# EAGLE design general (EAGLE 9.6.2)

## Sheet 1 of 4
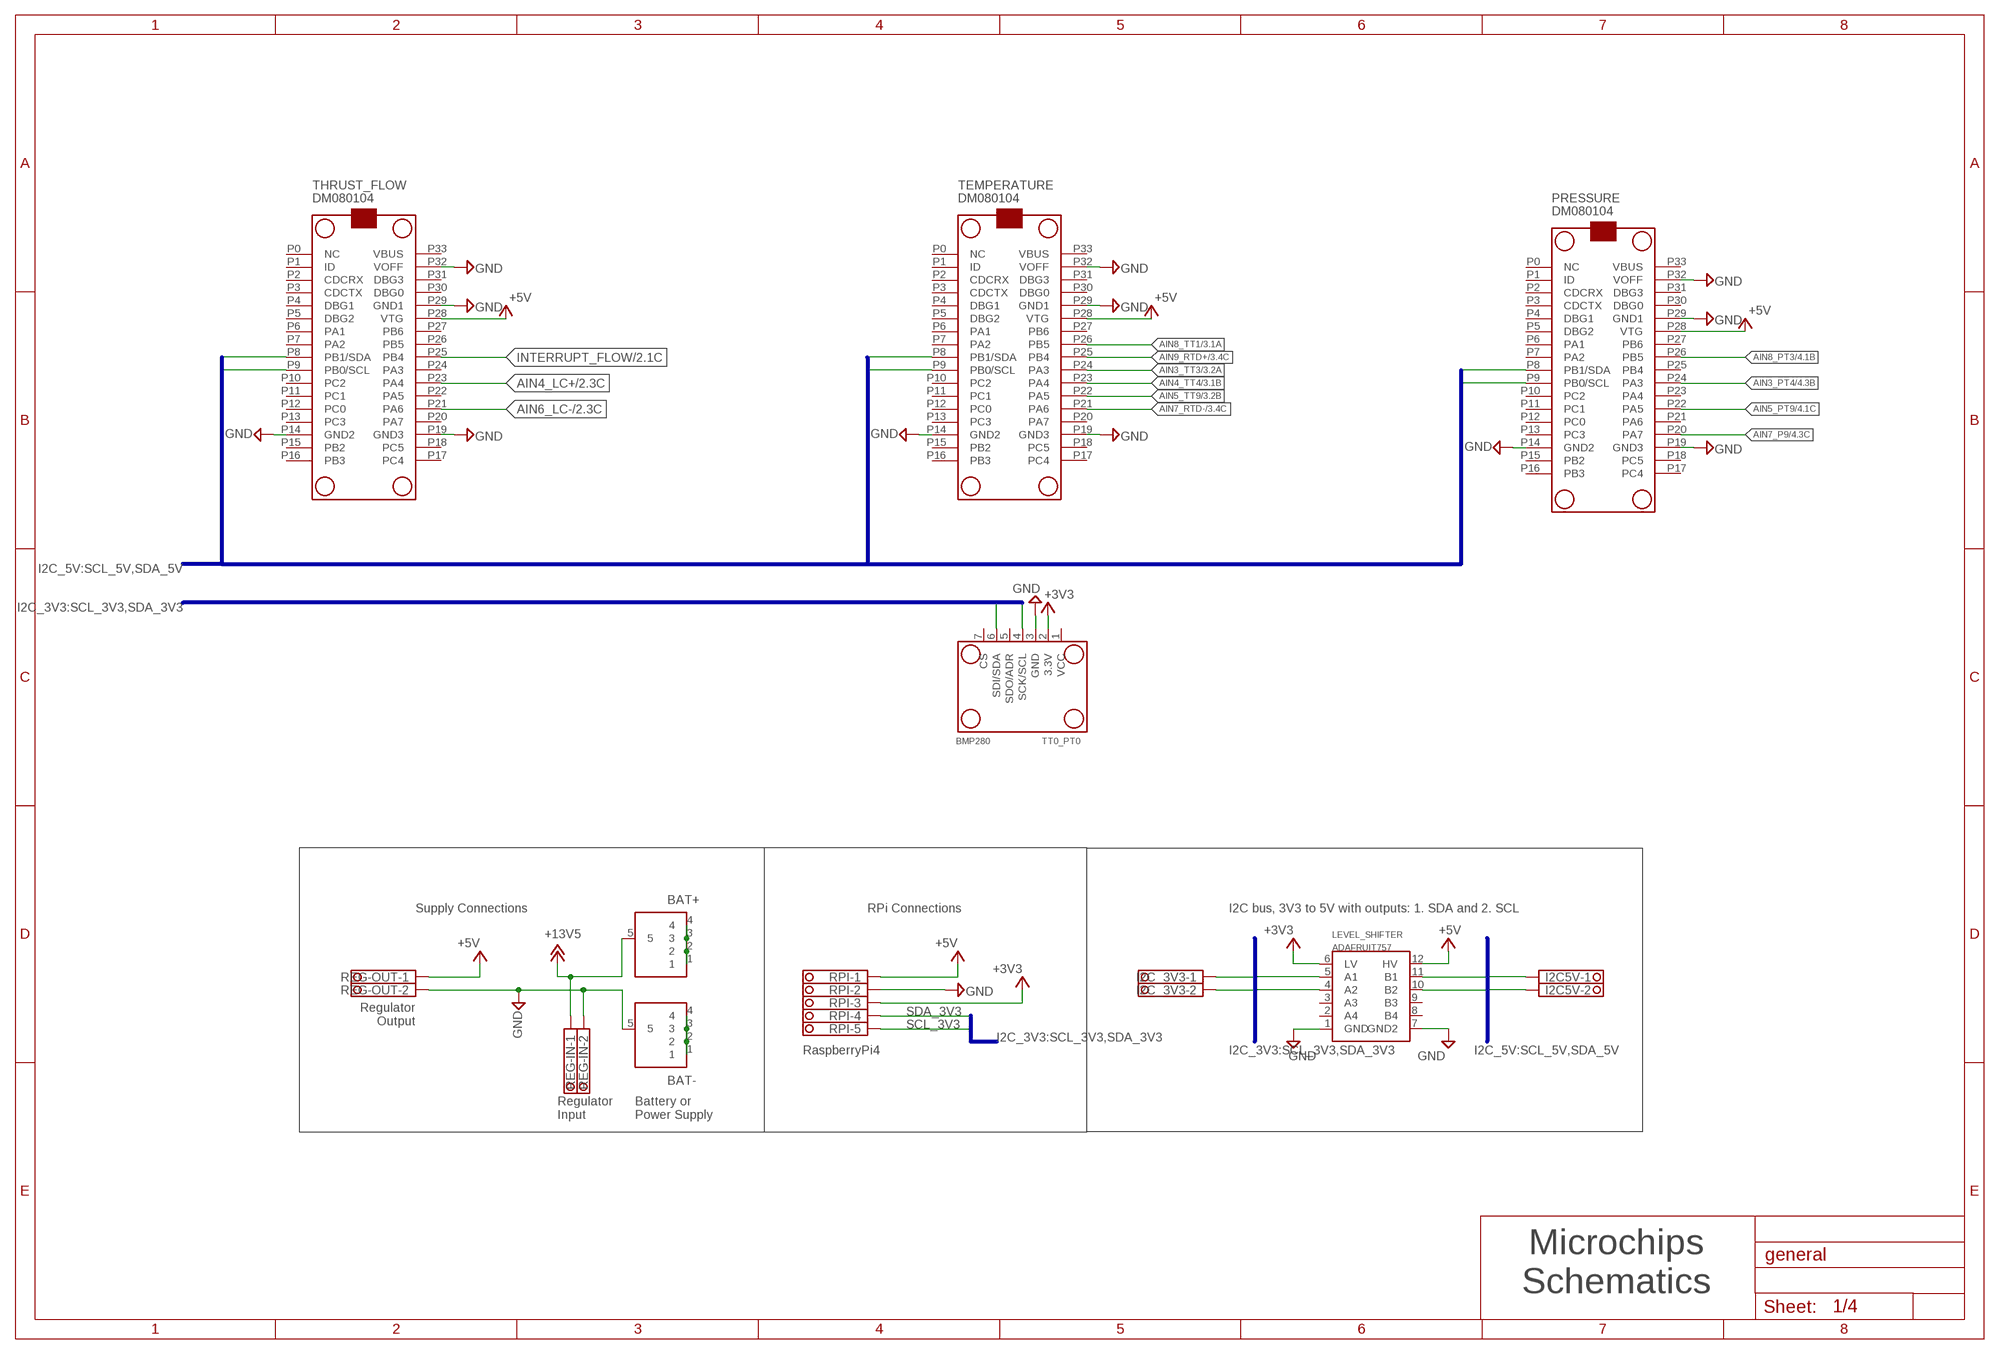
[diagram p0: schematic, sheet 1]

### Parts
BAT+  73099-2730990  [730990]
BAT-  73099-0  [730990]
I2C5V  1751248  [1751248]
I2C_3V3  1751248  [1751248]
LEVEL_SHIFTER  ADAFRUIT757  [ADAFRUIT757]
PRESSURE  DM080104  [DM080104]
REG-IN  1751248  [1751248]
REG-OUT  1751248  [1751248]
RPI  1751277  [1751277]
TEMPERATURE  DM080104  [DM080104]
THRUST_FLOW  DM080104  [DM080104]
TT0_PT0  BMP280  [BMP280]

### Nets
+3V3: LEVEL_SHIFTER.6(LV) RPI.3 TT0_PT0.2(3.3V) ; also sheet 4
+5V: LEVEL_SHIFTER.12(HV) PRESSURE.P28(VTG) REG-OUT.1 RPI.1 TEMPERATURE.P28(VTG) THRUST_FLOW.P28(VTG) ; also sheet 2,3
+13V5: BAT+.5 REG-IN.1 ; also sheet 4
AIN3_PT4: PRESSURE.P24(PA3) ; also sheet 4
AIN3_TT3: TEMPERATURE.P24(PA3) ; also sheet 3
AIN4_LC+: THRUST_FLOW.P23(PA4) ; also sheet 2
AIN4_TT4: TEMPERATURE.P23(PA4) ; also sheet 3
AIN5_PT9: PRESSURE.P22(PA5) ; also sheet 4
AIN5_TT9: TEMPERATURE.P22(PA5) ; also sheet 3
AIN6_LC-: THRUST_FLOW.P21(PA6) ; also sheet 2
AIN7_P9: PRESSURE.P20(PA7) ; also sheet 4
AIN7_RTD-: TEMPERATURE.P21(PA6) ; also sheet 3
AIN8_PT3: PRESSURE.P26(PB5) ; also sheet 4
AIN8_TT1: TEMPERATURE.P26(PB5) ; also sheet 3
AIN9_RTD+: TEMPERATURE.P25(PB4) ; also sheet 3
GND: BAT-.5 LEVEL_SHIFTER.1(GND) LEVEL_SHIFTER.7(GND2) PRESSURE.P14(GND2) PRESSURE.P19(GND3) PRESSURE.P29(GND1) PRESSURE.P32(VOFF) REG-IN.2 REG-OUT.2 RPI.2 TEMPERATURE.P14(GND2) TEMPERATURE.P19(GND3) TEMPERATURE.P29(GND1) TEMPERATURE.P32(VOFF) THRUST_FLOW.P14(GND2) THRUST_FLOW.P19(GND3) THRUST_FLOW.P29(GND1) THRUST_FLOW.P32(VOFF) TT0_PT0.3(GND) ; also sheet 2,3,4
INTERRUPT_FLOW: THRUST_FLOW.P25(PB4) ; also sheet 2
N$3: BAT+.1 BAT+.2 BAT+.3 BAT+.4
N$4: BAT-.1 BAT-.2 BAT-.3 BAT-.4
SCL_3V3: I2C_3V3.2 LEVEL_SHIFTER.4(A2) RPI.5 TT0_PT0.4(SCK/SCL) ; also sheet 4
SCL_5V: I2C5V.2 LEVEL_SHIFTER.10(B2) PRESSURE.P9(PB0/SCL) TEMPERATURE.P9(PB0/SCL) THRUST_FLOW.P9(PB0/SCL)
SDA_3V3: I2C_3V3.1 LEVEL_SHIFTER.5(A1) RPI.4 TT0_PT0.6(SDI/SDA) ; also sheet 4
SDA_5V: I2C5V.1 LEVEL_SHIFTER.11(B1) PRESSURE.P8(PB1/SDA) TEMPERATURE.P8(PB1/SDA) THRUST_FLOW.P8(PB1/SDA)
Unconnected: LEVEL_SHIFTER.2(A4) LEVEL_SHIFTER.3(A3) LEVEL_SHIFTER.8(B4) LEVEL_SHIFTER.9(B3) PRESSURE.P0(NC) PRESSURE.P1(ID) PRESSURE.P2(CDCRX) PRESSURE.P3(CDCTX) PRESSURE.P4(DBG1) PRESSURE.P5(DBG2) PRESSURE.P6(PA1) PRESSURE.P7(PA2) PRESSURE.P10(PC2) PRESSURE.P11(PC1) PRESSURE.P12(PC0) PRESSURE.P13(PC3) PRESSURE.P15(PB2) PRESSURE.P16(PB3) PRESSURE.P17(PC4) PRESSURE.P18(PC5) PRESSURE.P21(PA6) PRESSURE.P23(PA4) PRESSURE.P25(PB4) PRESSURE.P27(PB6) PRESSURE.P30(DBG0) PRESSURE.P31(DBG3) PRESSURE.P33(VBUS) TEMPERATURE.P0(NC) TEMPERATURE.P1(ID) TEMPERATURE.P2(CDCRX) TEMPERATURE.P3(CDCTX) TEMPERATURE.P4(DBG1) TEMPERATURE.P5(DBG2) TEMPERATURE.P6(PA1) TEMPERATURE.P7(PA2) TEMPERATURE.P10(PC2) TEMPERATURE.P11(PC1) TEMPERATURE.P12(PC0) TEMPERATURE.P13(PC3) TEMPERATURE.P15(PB2) TEMPERATURE.P16(PB3) TEMPERATURE.P17(PC4) TEMPERATURE.P18(PC5) TEMPERATURE.P20(PA7) TEMPERATURE.P27(PB6) TEMPERATURE.P30(DBG0) TEMPERATURE.P31(DBG3) TEMPERATURE.P33(VBUS) THRUST_FLOW.P0(NC) THRUST_FLOW.P1(ID) THRUST_FLOW.P2(CDCRX) THRUST_FLOW.P3(CDCTX) THRUST_FLOW.P4(DBG1) THRUST_FLOW.P5(DBG2) THRUST_FLOW.P6(PA1) THRUST_FLOW.P7(PA2) THRUST_FLOW.P10(PC2) THRUST_FLOW.P11(PC1) THRUST_FLOW.P12(PC0) THRUST_FLOW.P13(PC3) THRUST_FLOW.P15(PB2) THRUST_FLOW.P16(PB3) THRUST_FLOW.P17(PC4) THRUST_FLOW.P18(PC5) THRUST_FLOW.P20(PA7) THRUST_FLOW.P22(PA5) THRUST_FLOW.P24(PA3) THRUST_FLOW.P26(PB5) THRUST_FLOW.P27(PB6) THRUST_FLOW.P30(DBG0) THRUST_FLOW.P31(DBG3) THRUST_FLOW.P33(VBUS) TT0_PT0.1(VCC) TT0_PT0.5(SDO/ADR) TT0_PT0.7(CS)

### Buses
I2C_3V3:SCL_3V3,SDA_3V3
I2C_5V:SCL_5V,SDA_5V

### Notes on the sheet
- Supply Connections | RPi Connections | I2C bus, 3V3 to 5V with outputs: 1. SDA and 2. SCL
- Regulator
  Output
- RaspberryPi4
- Regulator
  Input
- Battery or
  Power Supply
- Microchips
  Schematics

## Sheet 2 of 4
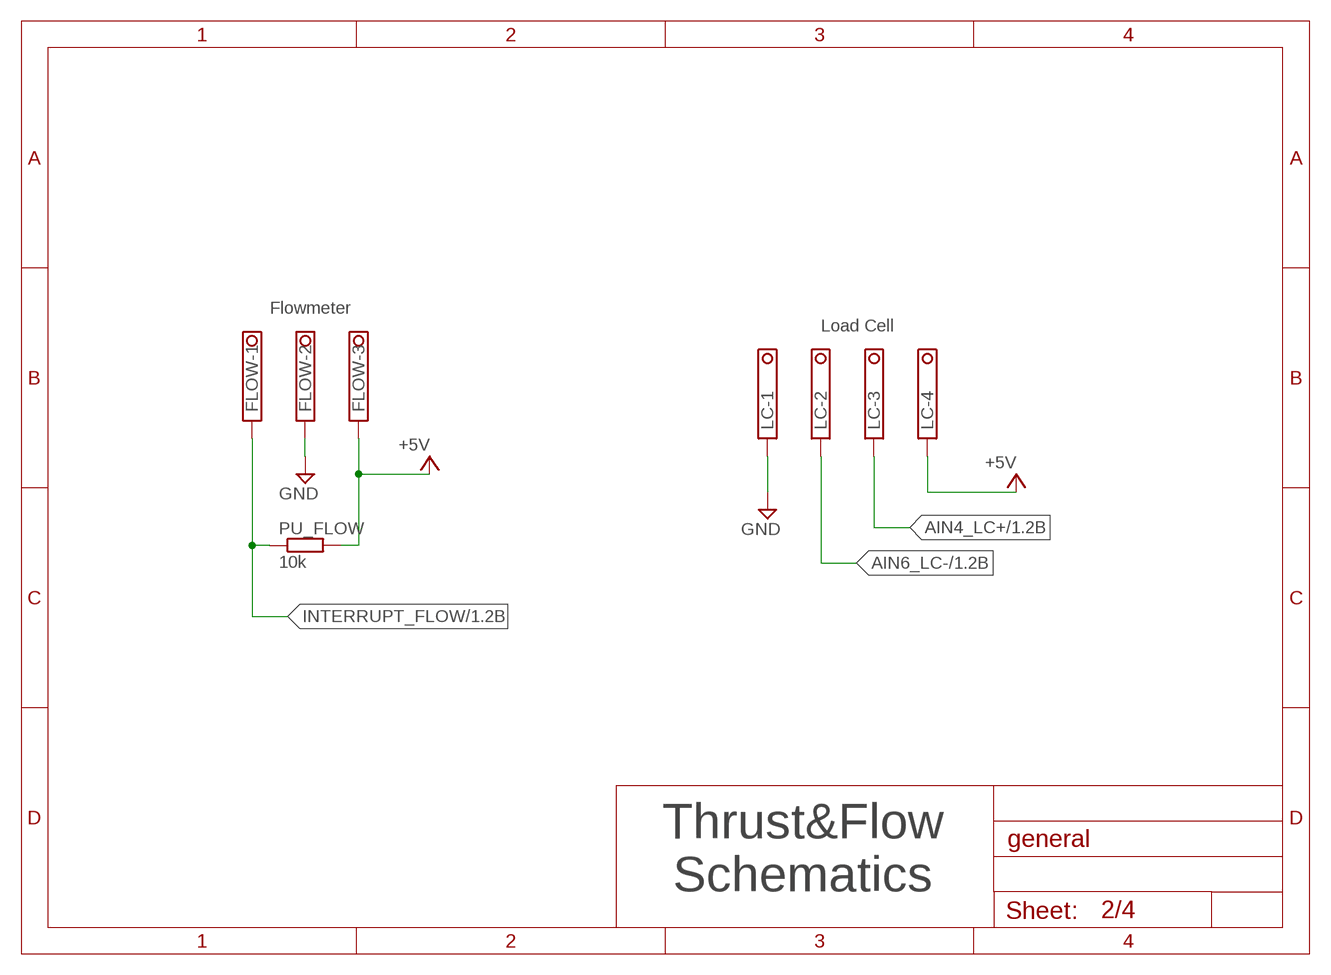
[diagram p1: schematic, sheet 2]

### Parts
FLOW  1751251  [1751251]
LC  1751264  [1751264]
PU_FLOW  10k  R-EU_0207/10  [0207/10]

### Nets
+5V: FLOW.3 LC.4 PU_FLOW.2 ; also sheet 1,3
AIN4_LC+: LC.3 ; also sheet 1
AIN6_LC-: LC.2 ; also sheet 1
GND: FLOW.2 LC.1 ; also sheet 1,3,4
INTERRUPT_FLOW: FLOW.1 PU_FLOW.1 ; also sheet 1

### Notes on the sheet
- Flowmeter
- Load Cell
- Thrust&Flow
  Schematics

## Sheet 3 of 4
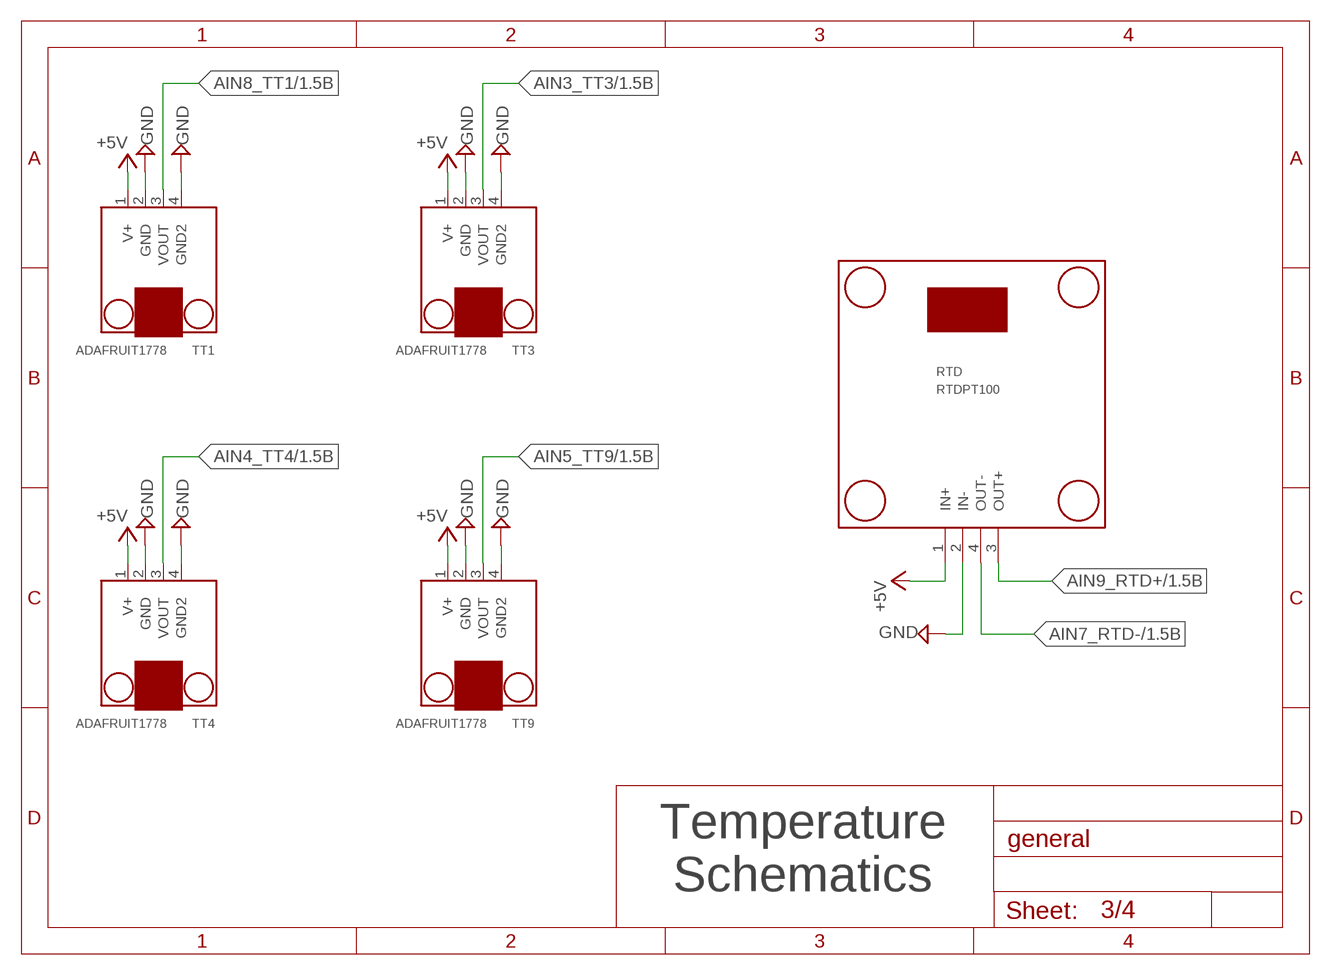
[diagram p2: schematic, sheet 3]

### Parts
RTD  RTDPT100  [RTDPT100]
TT1  ADAFRUIT1778  [ADAFRUIT1778]
TT3  ADAFRUIT1778  [ADAFRUIT1778]
TT4  ADAFRUIT1778  [ADAFRUIT1778]
TT9  ADAFRUIT1778  [ADAFRUIT1778]

### Nets
+5V: RTD.1(IN+) TT1.1(V+) TT3.1(V+) TT4.1(V+) TT9.1(V+) ; also sheet 1,2
AIN3_TT3: TT3.3(VOUT) ; also sheet 1
AIN4_TT4: TT4.3(VOUT) ; also sheet 1
AIN5_TT9: TT9.3(VOUT) ; also sheet 1
AIN7_RTD-: RTD.4(OUT-) ; also sheet 1
AIN8_TT1: TT1.3(VOUT) ; also sheet 1
AIN9_RTD+: RTD.3(OUT+) ; also sheet 1
GND: RTD.2(IN-) TT1.2(GND) TT1.4(GND2) TT3.2(GND) TT3.4(GND2) TT4.2(GND) TT4.4(GND2) TT9.2(GND) TT9.4(GND2) ; also sheet 1,2,4

### Notes on the sheet
- Temperature
  Schematics

## Sheet 4 of 4
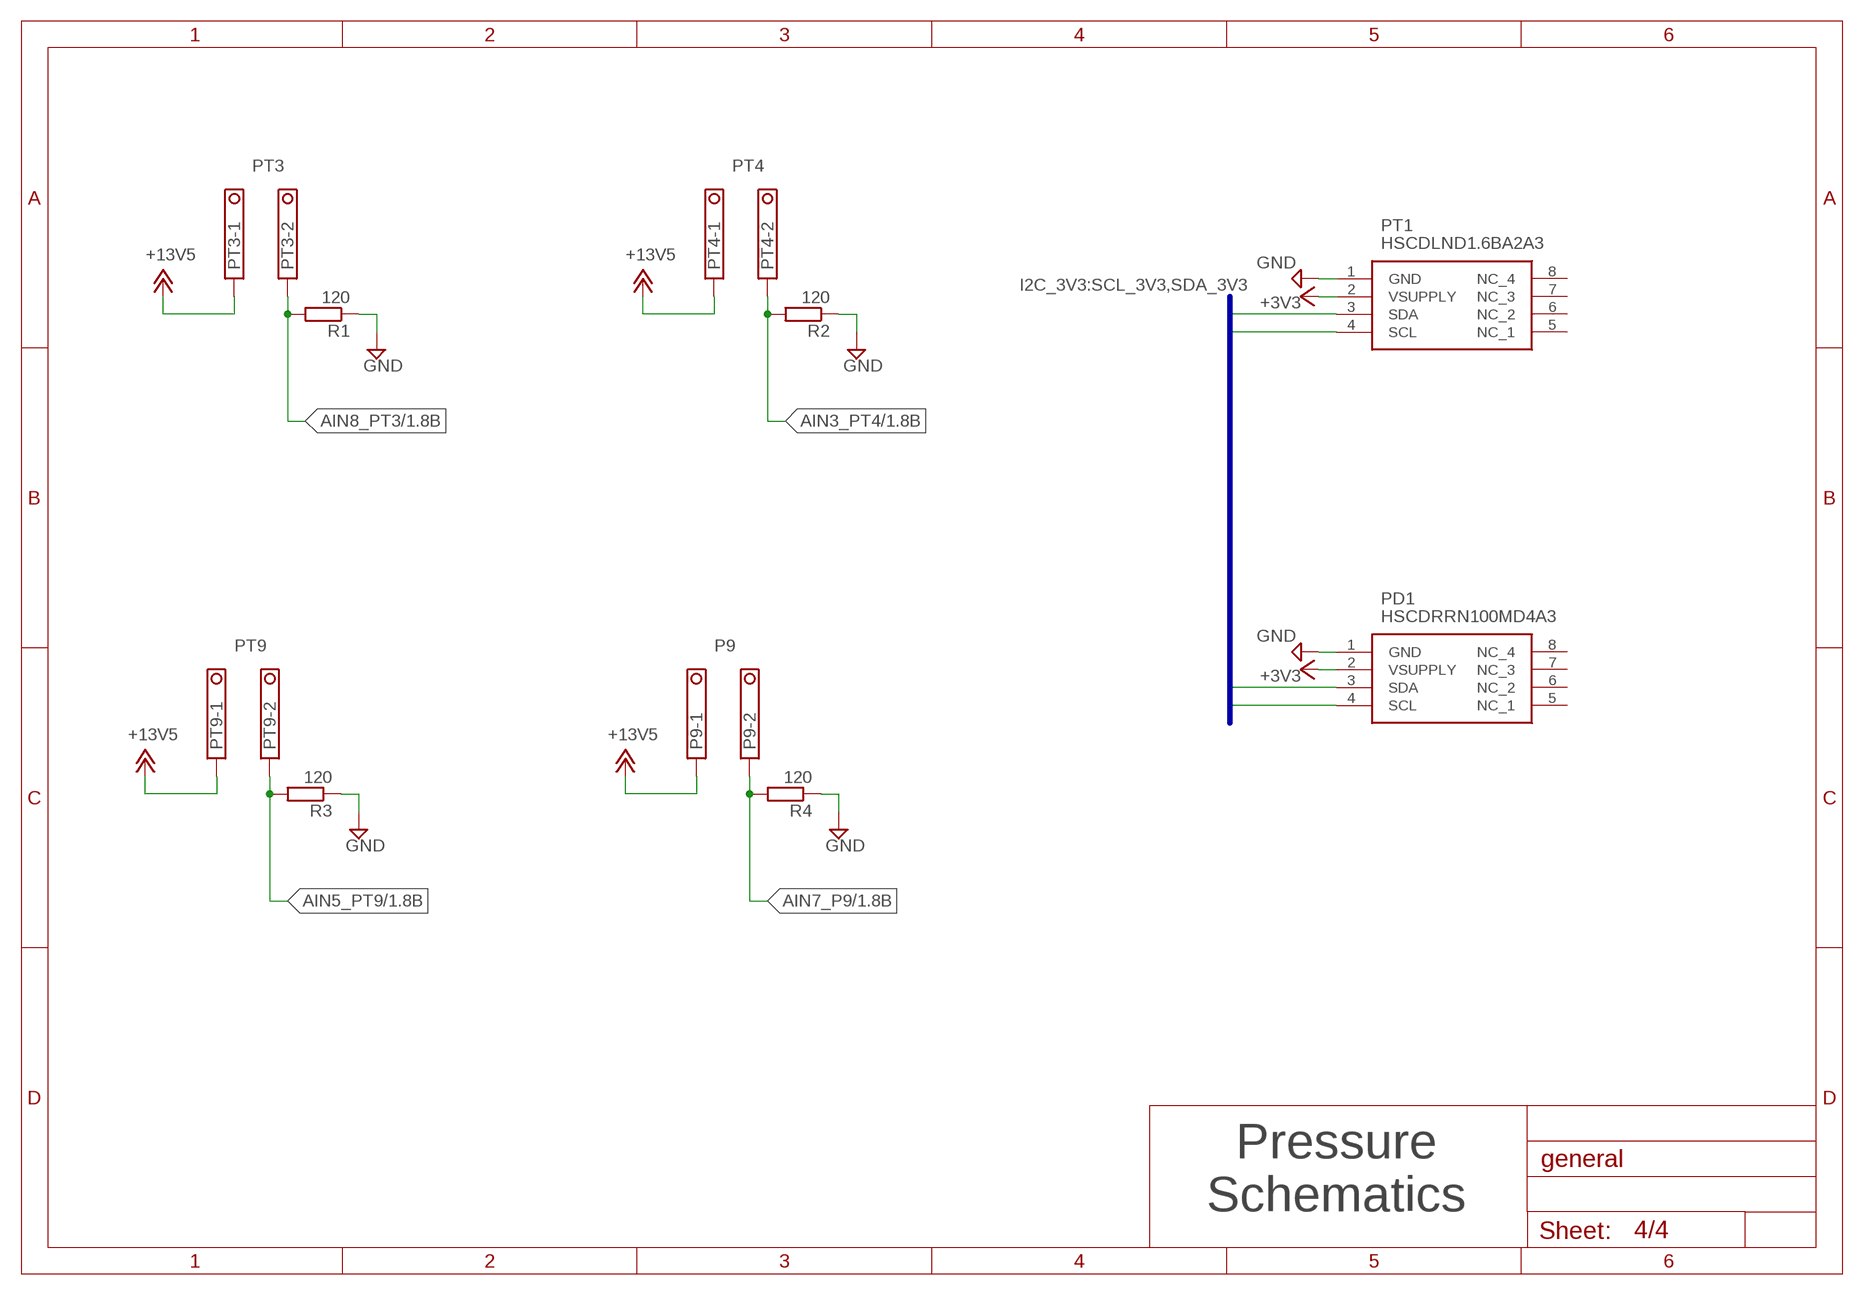
[diagram p3: schematic, sheet 4]

### Parts
P9  1751248  [1751248]
PD1  HSCDRRN100MD4A3  [HSCDRRN100MD4A3]
PT1  HSCDLND1.6BA2A3  [HSCDLND1.6BA2A3]
PT3  1751248  [1751248]
PT4  1751248  [1751248]
PT9  1751248  [1751248]
R1  120  R-EU_0207/10  [0207/10]
R2  120  R-EU_0207/10  [0207/10]
R3  120  R-EU_0207/10  [0207/10]
R4  120  R-EU_0207/10  [0207/10]

### Nets
+3V3: PD1.2(VSUPPLY) PT1.2(VSUPPLY) ; also sheet 1
+13V5: P9.1 PT3.1 PT4.1 PT9.1 ; also sheet 1
AIN3_PT4: PT4.2 R2.2 ; also sheet 1
AIN5_PT9: PT9.2 R3.2 ; also sheet 1
AIN7_P9: P9.2 R4.2 ; also sheet 1
AIN8_PT3: PT3.2 R1.2 ; also sheet 1
GND: PD1.1(GND) PT1.1(GND) R1.1 R2.1 R3.1 R4.1 ; also sheet 1,2,3
SCL_3V3: PD1.4(SCL) PT1.4(SCL) ; also sheet 1
SDA_3V3: PD1.3(SDA) PT1.3(SDA) ; also sheet 1
Unconnected: PD1.5(NC_1) PD1.6(NC_2) PD1.7(NC_3) PD1.8(NC_4) PT1.5(NC_1) PT1.6(NC_2) PT1.7(NC_3) PT1.8(NC_4)

### Buses
I2C_3V3:SCL_3V3,SDA_3V3

### Notes on the sheet
- PT3 | PT4
- PT9 | P9
- Pressure
  Schematics

## Library data of the parts
BAT+ = general_lib:73099-2: Test Plugs & Test Jacks RT ANG 4mm MOUNTING SAFETY JACK PCB RED Source: Datasheet <https://www.mouser.com/datasheet/2/159/d73099_101-1649201.pdf>
BAT- = general_lib:73099-0: Test Plugs & Test Jacks RT ANG 4mm MOUNTING SAFETY JACK PCB BLK Source: Datasheet <http://assets.edgenet.com/bc247afe-c6d3-4b5e-af4b-80e7f9cda64b>; DESCRIPTION: Test Plugs & Test Jacks RT ANG 4mm MOUNTING SAFETY JACK PCB BLK; HEIGHT: 11.5mm; MANUFACTURER_NAME: Pomona Electronics; MANUFACTURER_PART_NUMBER: 73099-0; MOUSER_PART_NUMBER: 565-73099-0; MOUSER_PRICE-STOCK: https://www.mouser.co.uk/ProductDetail/Pomona-Electronics/73099-0?qs=B6kkDfuK7%2FDgwxUVoyhL3Q%3D%3D
FLOW = con-phoenix-350:1751251: MKDS 1/ 3-3,5 Printklemme Nennstrom: 10 A Bemessungsspannung: 160 V Raster: 3,5 mm Polzahl: 3 Montageart: Löten Anschlussart: Schraubanschluss Anschlussrichtung vom Leiter zur Platine: 0° Source: http://eshop.phoenixcontact.com .. 1751251.pdf; OC_FARNELL: unknown; OC_NEWARK: unknown
I2C5V I2C_3V3 P9 PT3 PT4 PT9 REG-IN REG-OUT = con-phoenix-350:1751248: MKDS 1/ 2-3,5 Printklemme Nennstrom: 10 A Bemessungsspannung: 160 V Raster: 3,5 mm Polzahl: 2 Montageart: Löten Anschlussart: Schraubanschluss Anschlussrichtung vom Leiter zur Platine: 0° Source: http://eshop.phoenixcontact.com .. 1751248.pdf; OC_FARNELL: unknown; OC_NEWARK: unknown
LC = con-phoenix-350:1751264: MKDS 1/ 4-3,5 Printklemme Nennstrom: 10 A Bemessungsspannung: 160 V Raster: 3,5 mm Polzahl: 4 Montageart: Löten Anschlussart: Schraubanschluss Anschlussrichtung vom Leiter zur Platine: 0° Source: http://eshop.phoenixcontact.com .. 1751264.pdf; MPN: 1751264; OC_FARNELL: unknown; OC_NEWARK: 10R0934
LEVEL_SHIFTER = general_lib:ADAFRUIT757
PD1 = general_lib:HSCDRRN100MD4A3: Board Mount Pressure Sensors DIP, Dual Rad Barbed Differential, 3.3V Source: Datasheet <https://www.mouser.es/datasheet/2/187/honeywell_sensing_trustability_hsc_series_high_acc-708740.pdf>; DESCRIPTION: Board Mount Pressure Sensors DIP, Dual Rad Barbed Differential, 3.3V; HEIGHT: 6.16mm; MANUFACTURER_NAME: Honeywell; MANUFACTURER_PART_NUMBER: HSCDRRN100MD4A3; MOUSER_PART_NUMBER: 785-HSCDRRN100MD4A3; MOUSER_PRICE-STOCK: https://www.mouser.co.uk/ProductDetail/Honeywell/HSCDRRN100MD4A3?qs=FIB5FJLAMZMg5BM%252B2yGYjw%3D%3D
PRESSURE TEMPERATURE THRUST_FLOW = general_lib:DM080104
PT1 = general_lib:HSCDLND1.6BA2A3: Board Mount Pressure Sensors DIP, Dual Rad Barbed Differential, 3.3V Source: Datasheet <https://www.mouser.es/datasheet/2/187/honeywell_sensing_trustability_hsc_series_high_acc-708740.pdf>
PU_FLOW R1-R4 = rcl:R-EU_: RESISTOR, European symbol; SPICEPREFIX: R
RPI = con-phoenix-350:1751277: MKDS 1/ 5-3,5 Printklemme Nennstrom: 10 A Bemessungsspannung: 160 V Raster: 3,5 mm Polzahl: 5 Montageart: Löten Anschlussart: Schraubanschluss Anschlussrichtung vom Leiter zur Platine: 0° Source: http://eshop.phoenixcontact.com .. 1751277.pdf; OC_FARNELL: unknown; OC_NEWARK: unknown
RTD = general_lib:RTDPT100
TT0_PT0 = general_lib:BMP280
TT1 TT3 TT4 TT9 = general_lib:ADAFRUIT1778

## Board
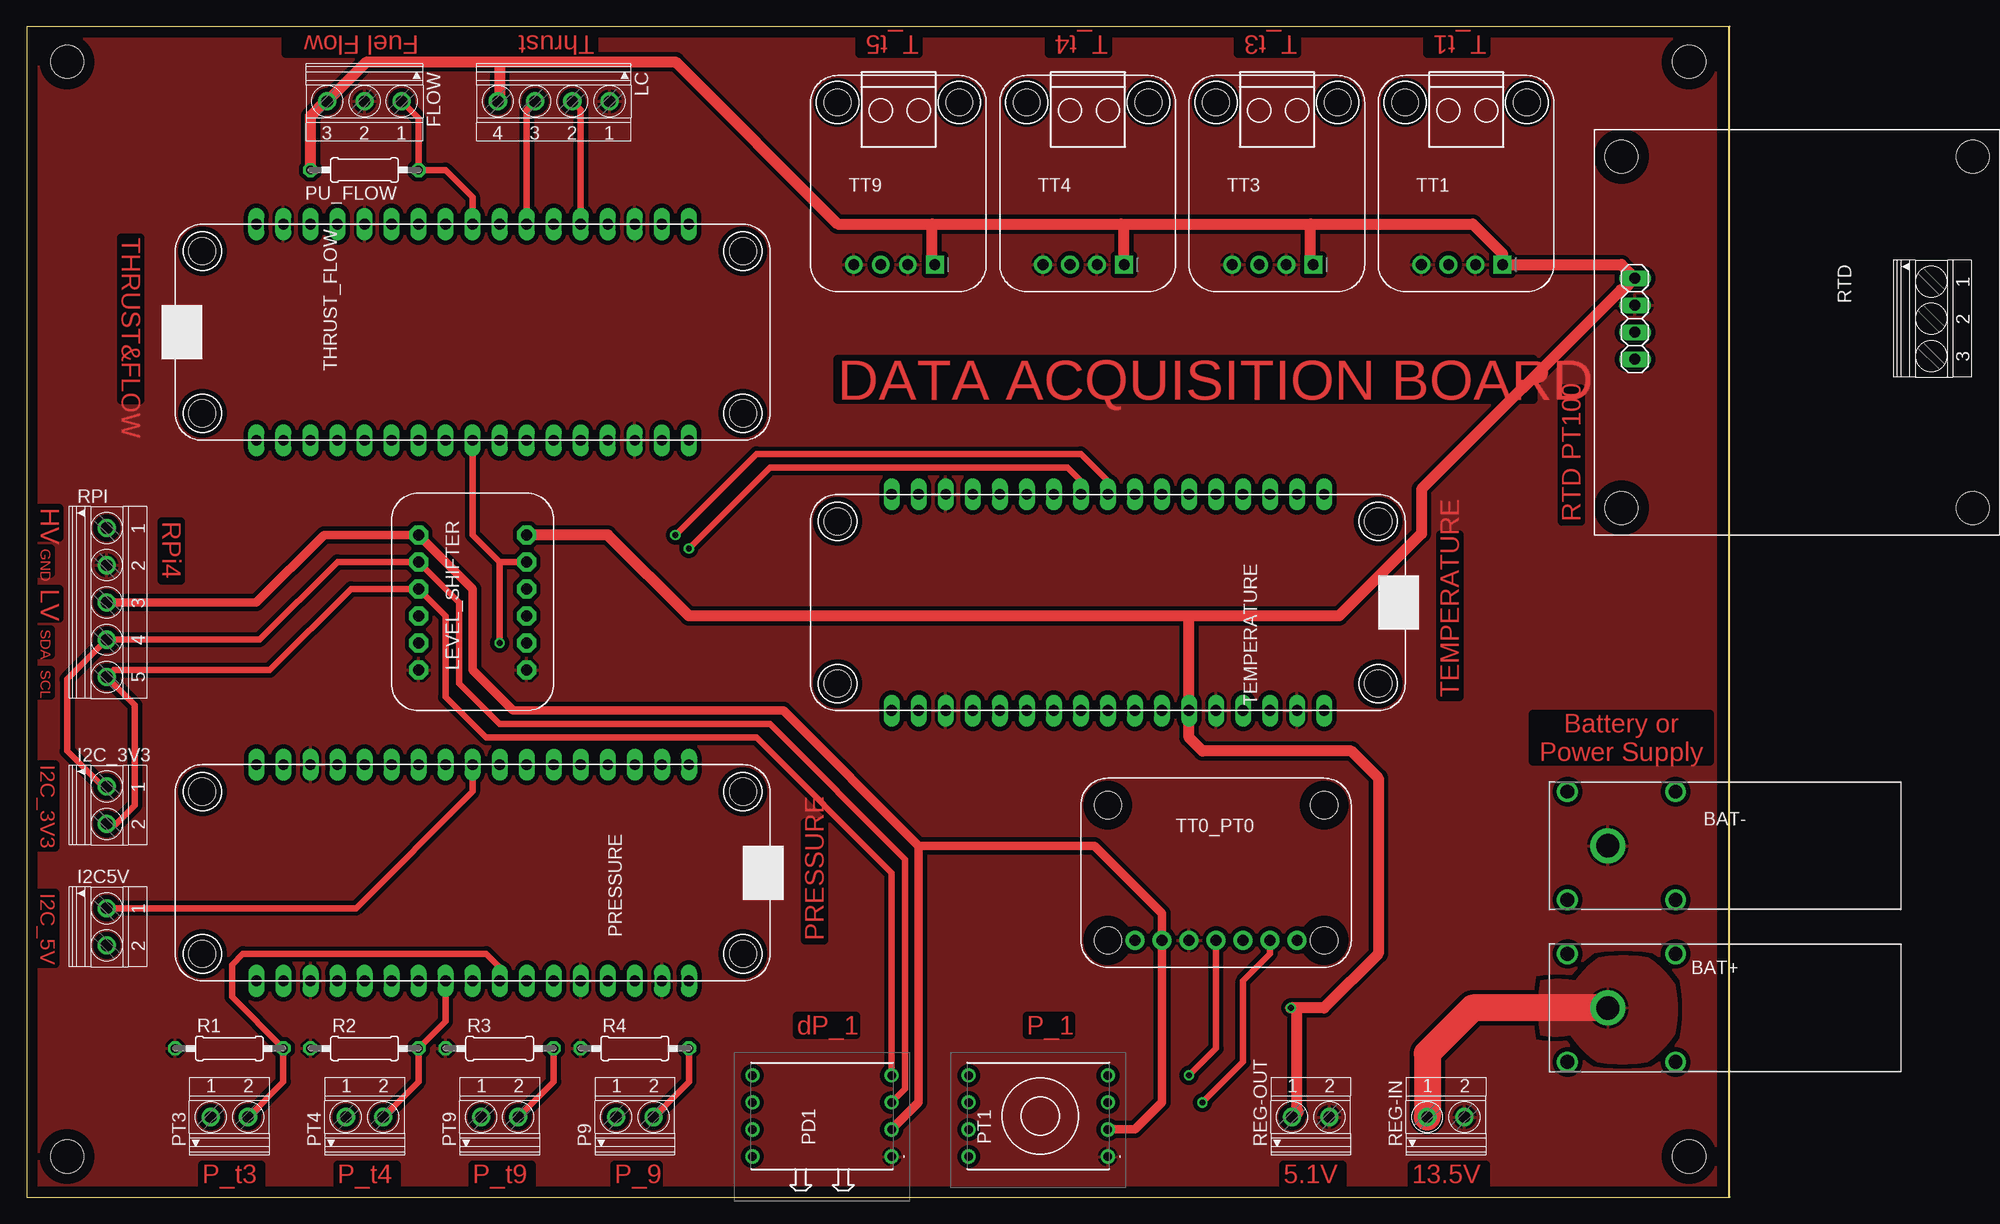
[diagram p4: board, top side]
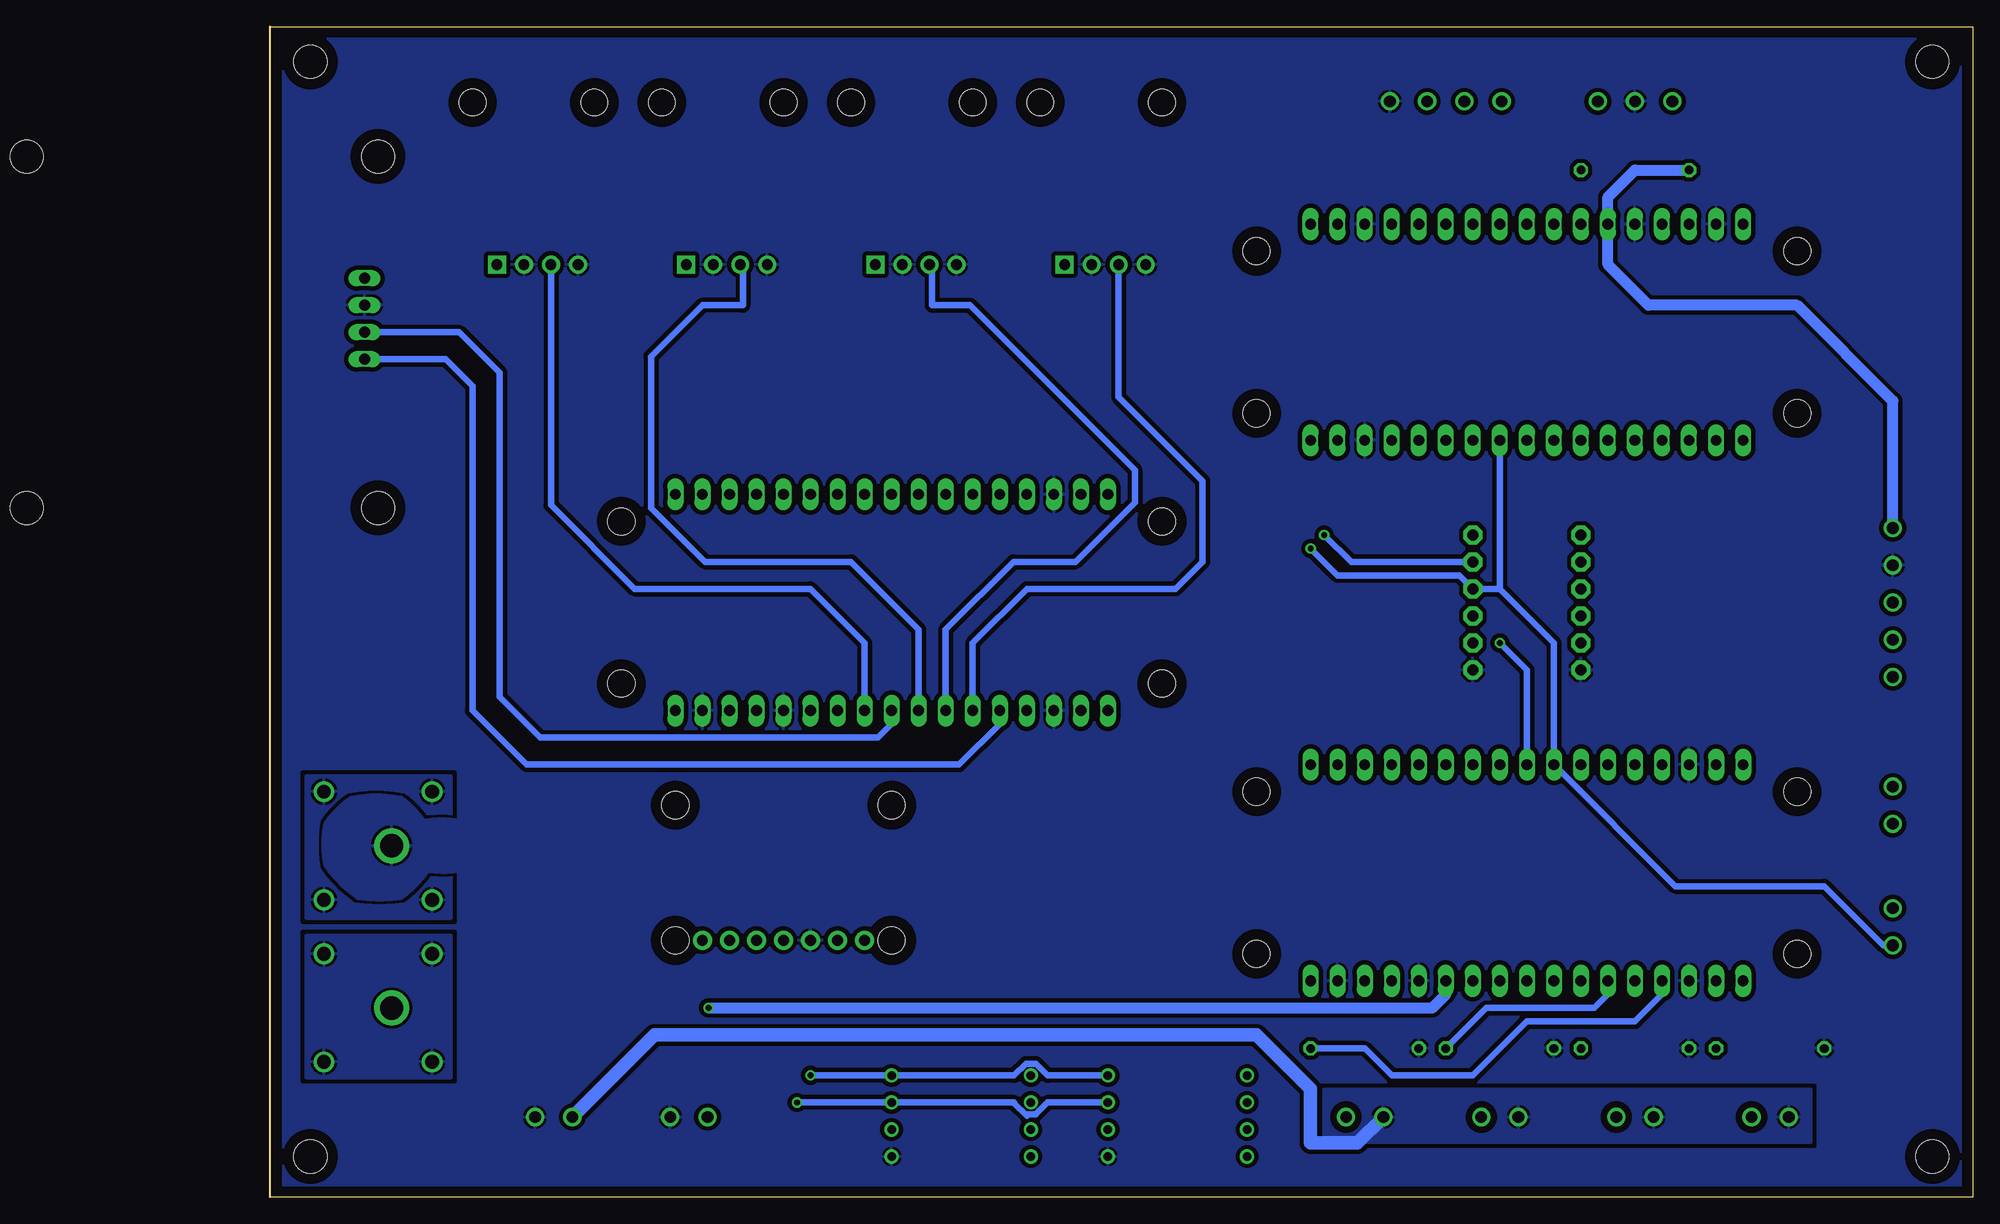
[diagram p5: board, bottom side, seen from below]

Size 160 x 110 mm. Coordinates in mm from the lower left corner, seen from the top.
Outline: 0,0 160,0 160,110 0,110 0,0
Copper layers (1*16): Top 0.035mm / dielectric 1.5mm / Bottom 0.035mm
Design rules "default *": minimum track width 2mil, minimum drill 0.35mm, track to track 6mil, track to pad 6mil, pad to pad 6mil, via to via 6mil, smd to smd 6mil, copper to edge 40mil, drill to drill 6mil, minimum pad ring 10mil, minimum via ring 8mil, stop-mask expansion 4mil, vias tented up to drill 0mil, thermal gap 10mil
Holes 3.1 mm at 3.81,106.68 156.21,106.68 156.21,3.81 3.81,3.81

### Footprints (pad centres in the part's own frame; a part is rotated, then mirrored left to right if it is on the bottom)
730990 = drill 1.3 pad 1.95: 1 0,0; 2 0,-10.16; 3 10.16,-10.16; 4 10.16,0 | drill 2.2 pad 3.3: 5 3.8,-5.08
1751251 = drill 1.1 pad 1.7: 1 -3.5,-0.1; 2 0,-0.1; 3 3.5,-0.1
1751248 = drill 1.1 pad 1.7: 1 -1.75,-0.1; 2 1.75,-0.1
1751264 = drill 1.1 pad 1.7: 1 -5.25,-0.1; 2 -1.75,-0.1; 3 1.75,-0.1; 4 5.25,-0.1
ADAFRUIT757 = drill 1.016 pad 1.778 octagon: 1 2.54,3.81; 2 2.54,6.35; 3 2.54,8.89; 4 2.54,11.43; 5 2.54,13.97; 6 2.54,16.51; 7 12.7,3.81; 8 12.7,6.35; 9 12.7,8.89; 10 12.7,11.43; 11 12.7,13.97; 12 12.7,16.51
HSCDRRN100MD4A3 = drill 0.813 pad 1.321: 1 0,0; 2 2.54,0; 3 5.08,0; 4 7.62,0; 5 7.62,13.08; 6 5.08,13.08; 7 2.54,13.08; 8 0,13.08
DM080104 = drill 1.016 long: P0 0,-7.62; P1 0,-10.16; P2 0,-12.7; P3 0,-15.24; P4 0,-17.78; P5 0,-20.32; P6 0,-22.86; P7 0,-25.4; P8 0,-27.94; P9 0,-30.48; P10 0,-33.02; P11 0,-35.56; P12 0,-38.1; P13 0,-40.64; P14 0,-43.18; P15 0,-45.72; P16 0,-48.26; P17 20.32,-48.26; P18 20.32,-45.72; P19 20.32,-43.18; P20 20.32,-40.64; P21 20.32,-38.1; P22 20.32,-35.56; P23 20.32,-33.02; P24 20.32,-30.48; P25 20.32,-27.94; P26 20.32,-25.4; P27 20.32,-22.86; P28 20.32,-20.32; P29 20.32,-17.78; P30 20.32,-15.24; P31 20.32,-12.7; P32 20.32,-10.16; P33 20.32,-7.62 | hole 2.54: 2.54,-2.54; 17.78,-2.54; 17.78,-53.34; 2.54,-53.34
HSCDLND1.6BA2A3 = drill 0.813 pad 1.321: 1 0,0; 2 2.54,0; 3 5.08,0; 4 7.62,0; 5 7.62,13.08; 6 5.08,13.08; 7 2.54,13.08; 8 0,13.08
0207/10 = drill 0.813 octagon: 1 -5.08,0; 2 5.08,0
1751277 = drill 1.1 pad 1.7: 1 -7,-0.1; 2 -3.5,-0.1; 3 0,-0.1; 4 3.5,-0.1; 5 7,-0.1
RTDPT100 = drill 1.016 long: 1 13.97,3.81; 2 16.51,3.81; 3 19.05,3.81; 4 21.59,3.81 | hole 3.1: 2.54,2.54; 35.56,2.54; 35.56,35.56; 2.54,35.56
BMP280 = drill 1.016 pad 1.778: 1 5.08,2.54; 2 7.62,2.54; 3 10.16,2.54; 4 12.7,2.54; 5 15.24,2.54; 6 17.78,2.54; 7 20.32,2.54 | hole 2.54: 2.54,15.24; 22.86,15.24; 22.86,2.54; 2.54,2.54
ADAFRUIT1778 = drill 1 pad 1.676 square: 1 17.78,11.684 | drill 1 pad 1.676: 2 17.78,9.144; 3 17.78,6.604; 4 17.78,4.064 | hole 2.5: 2.54,13.97; 2.54,2.54

### Placement (x,y rotation side)
BAT+  144.78,22.86 0 top
BAT-  144.78,38.1 0 top
FLOW  31.75,102.87 180 top
I2C5V  7.62,25.4 270 top
I2C_3V3  7.62,36.83 270 top
LC  49.53,102.87 180 top
LEVEL_SHIFTER  34.29,45.72 0 top
P9  57.15,7.62 0 top
PD1  81.28,3.81 90 top
PRESSURE  69.85,40.64 270 top
PT1  101.6,3.81 90 top
PT3  19.05,7.62 0 top
PT4  31.75,7.62 0 top
PT9  44.45,7.62 0 top
PU_FLOW  31.75,96.52 180 top
R1  19.05,13.97 0 top
R2  31.75,13.97 0 top
R3  44.45,13.97 0 top
R4  57.15,13.97 0 top
REG-IN  133.35,7.62 0 top
REG-OUT  120.65,7.62 0 top
RPI  7.62,55.88 270 top
RTD  147.32,100.33 270 top
TEMPERATURE  129.54,66.04 270 top
THRUST_FLOW  13.97,71.12 90 top
TT0_PT0  99.06,21.59 0 top
TT1  127,105.41 270 top
TT3  109.22,105.41 270 top
TT4  91.44,105.41 270 top
TT9  73.66,105.41 270 top

### Tracks (layer width: path | path; a pad name or v marks a point on that pad's centre or on a via)
+3V3
  Top 0.813: RPI.3 21.59,55.88 27.94,62.23 LEVEL_SHIFTER.6 41.91,57.15 41.91,49.53 45.72,45.72 71.12,45.72 83.82,33.02 | 83.82,33.02 83.82,8.89 PD1.2 | 83.82,33.02 100.33,33.02 106.68,26.67 TT0_PT0.2 106.68,8.89 104.14,6.35 PT1.2
+5V  (via drill 0.55)
  Top 1.016: 109.22,54.61 62.23,54.61 54.61,62.23 LEVEL_SHIFTER.12 | 85.09,91.44 76.2,91.44 60.96,106.68 44.45,106.68 | 85.09,91.44 102.87,91.44 | 102.87,91.44 120.65,91.44 | 120.65,91.44 135.89,91.44 138.68,88.65 TT1.1 149.86,87.63 RTD.1 150.01,85.24 149.78,85.24 131.06,66.53 131.06,62.34 123.33,54.61 109.22,54.61 | TT9.1 85.09,87.88 85.09,91.44 | TT4.1 103.12,91.19 102.87,91.44 | TT3.1 120.65,87.88 120.65,91.44 | 44.45,106.68 31.96,106.68 FLOW.3 28.04,102.97 26.67,101.6 PU_FLOW.2 | 44.45,106.68 44.45,103.14 LC.4 | 109.22,54.61 TEMPERATURE.P28 109.22,43.18 110.49,41.91 124.46,41.91 127,39.37 127,22.86 121.92,17.78 119.38,17.78 | 119.38,17.78 v118.8,17.78 | 119.38,8 119.38,17.78
  Top 1.27: REG-OUT.1 119.38,8
  Bottom 1.016: PU_FLOW.2 31.75,96.52 34.29,93.98 THRUST_FLOW.P28 34.29,87.63 30.48,83.82 16.51,83.82 7.52,74.83 RPI.1 | v118.8,17.78 50.8,17.78 49.53,19.05 PRESSURE.P28
+13V5
  Top 2.54: BAT+.5 135.89,17.78 131.6,13.49 REG-IN.1
  Bottom 1.27: REG-IN.1 123.88,15.24 67.31,15.24 62.23,10.16 62.23,5.08 57.84,5.08 P9.1
  pour Bottom (isolate 0.61): 15.24,10.16 15.24,5.08 60.96,5.08 60.96,10.16
  pour Top (isolate 0.406): 142.24,20.32 arc20 142.24,15.24 arc20 145.03,15.24 arc20 147.57,12.7 arc20 152.27,12.7 arc20 154.94,15.37 arc20 154.94,19.94 arc20 152.4,22.48 arc20 147.7,22.48 arc20 145.54,20.32 arc20
AIN3_PT4
  Top 0.61: PT4.2 36.83,10.85 R2.2 39.37,16.51 PRESSURE.P24
AIN3_TT3
  Bottom 0.61: TEMPERATURE.P24 99.06,53.34 105.41,59.69 119.13,59.69 124.21,64.77 124.21,78.99 119.38,83.82 115.57,83.82 115.57,87.38 TT3.3
AIN4_LC+
  Top 0.61: LC.3 46.99,102.18 THRUST_FLOW.P23
AIN4_TT4
  Bottom 0.61: TEMPERATURE.P23 96.52,53.34 90.17,59.69 84.33,59.69 78.74,65.28 78.74,68.33 94.23,83.82 97.79,83.82 97.79,87.38 TT4.3
AIN5_PT9
  Top 0.61: PT9.2 49.53,10.85 R3.2
  Bottom 0.61: R3.2 45.72,17.78 35.56,17.78 34.29,19.05 PRESSURE.P22
AIN5_TT9
  Bottom 0.61: TT9.3 80.26,75.18 72.39,67.31 72.39,59.69 74.93,57.15 88.9,57.15 93.98,52.07 TEMPERATURE.P22
AIN6_LC-
  Top 0.61: LC.2 52.07,102.18 THRUST_FLOW.P21
AIN7_P9
  Top 0.61: P9.2 62.23,10.85 R4.2
  Bottom 0.61: PRESSURE.P20 29.21,19.05 31.75,16.51 41.91,16.51 46.99,11.43 54.61,11.43 57.15,13.97 R4.2
AIN7_RTD-
  Bottom 0.61: RTD.4 143.51,78.74 140.97,76.2 140.97,45.72 135.89,40.64 95.25,40.64 91.44,44.45 TEMPERATURE.P21
AIN8_PT3
  Top 0.61: PT3.2 24.13,10.85 R1.2 19.3,18.8 19.3,21.84 20.32,22.86 43.18,22.86 44.45,21.59 PRESSURE.P26
AIN8_TT1
  Bottom 0.61: TT1.3 133.6,65.02 125.73,57.15 109.22,57.15 104.14,52.07 TEMPERATURE.P26
AIN9_RTD+
  Bottom 0.61: RTD.3 142.24,81.28 138.43,77.47 138.43,46.99 134.62,43.18 102.87,43.18 101.6,44.45 TEMPERATURE.P25
GND
  pour Bottom (isolate 0.406, rank 5): 0,110 0,0 160,0 160,110
  pour Bottom (isolate 0.406): 142.24,35.56 arc20 142.24,30.48 arc20 145.16,30.48 arc20 147.7,27.94 arc20 151.76,27.94 arc20 154.94,31.11 arc20 154.94,35.18 arc20 152.4,37.72 arc20 147.7,37.72 arc20 145.54,35.56 arc20
  pour Top (isolate 0.406, rank 3): 0,110 0,0 160,0 160,110
INTERRUPT_FLOW
  Top 0.61: FLOW.1 36.83,101.39 PU_FLOW.1 39.37,96.52 41.91,93.98 THRUST_FLOW.P25
N$3
  pour Bottom (isolate 0.254, rank 2): 143,24.64 143,11.18 156.59,11.18 156.59,24.64
N$4
  pour Bottom (isolate 0.254, rank 2): 143,39.62 143,26.16 156.59,26.16 156.59,39.62
SCL_3V3  (via drill 0.55)
  Top 0.61: I2C_3V3.2 8.41,35.08 10.16,36.83 10.16,46.24 RPI.5 8.17,49.53 22.86,49.53 30.48,57.15 LEVEL_SHIFTER.4 39.37,54.61 39.37,46.99 43.18,43.18 68.58,43.18 81.28,30.48 PD1.4 | v109.22,11.43 111.76,13.97 TT0_PT0.4
  Bottom 0.61: PD1.4 86.94,11.43 88.06,12.55 88.98,12.55 90.1,11.43 PT1.4 v109.22,11.43
SCL_5V  (via drill 0.55)
  Top 0.61: TEMPERATURE.P9 99.06,67.31 97.79,68.58 69.85,68.58 v62.23,60.96
  Bottom 0.61: 44.45,57.15 39.37,52.07 PRESSURE.P9 27.94,29.21 13.97,29.21 8.41,23.65 I2C5V.2 | 44.45,57.15 THRUST_FLOW.P9 | v62.23,60.96 59.69,58.42 48.26,58.42 LEVEL_SHIFTER.10 44.45,57.15
SDA_3V3  (via drill 0.55)
  Top 0.61: I2C_3V3.1 7.14,38.58 3.81,41.91 3.81,48.67 RPI.4 21.9,52.38 29.21,59.69 LEVEL_SHIFTER.5 40.64,55.88 40.64,48.26 44.45,44.45 69.85,44.45 82.55,31.75 82.55,10.16 PD1.3 | v110.49,8.89 114.3,12.7 114.3,20.32 116.84,22.86 TT0_PT0.6
  Bottom 0.61: PD1.3 86.94,8.89 87.92,7.91 88.06,7.77 88.75,7.77 88.9,7.62 90.1,8.82 90.1,8.89 PT1.3 v110.49,8.89
SDA_5V  (via drill 0.55)
  Top 0.61: PRESSURE.P8 41.91,38.1 30.96,27.15 I2C5V.1 | v60.96,62.23 68.58,69.85 99.06,69.85 101.6,67.31 TEMPERATURE.P8 | 44.45,59.69 41.91,62.23 THRUST_FLOW.P8 | v44.45,52.07 44.45,59.69 | LEVEL_SHIFTER.11 44.45,59.69
  Bottom 0.61: LEVEL_SHIFTER.11 58.42,59.69 v60.96,62.23 | v44.45,52.07 41.91,49.53 PRESSURE.P8

### Text on the board
Top: Fuel Flow | Thrust | T_t5 | T_t4 | T_t3 | T_t1 | THRUST&FLOW | DATA ACQUISITION BOARD | HV | RPi4 | RTD PT100 | GND | LV | SDA | SCL | TEMPERATURE | Battery or / Power Supply | I2C_3V3 | I2C_5V | PRESSURE | dP_1 | P_1 | P_t3 | P_t4 | P_t9 | P_9 | 5.1V | 13.5V